# EAGLE design mcp2200 (EAGLE 9.0.0)
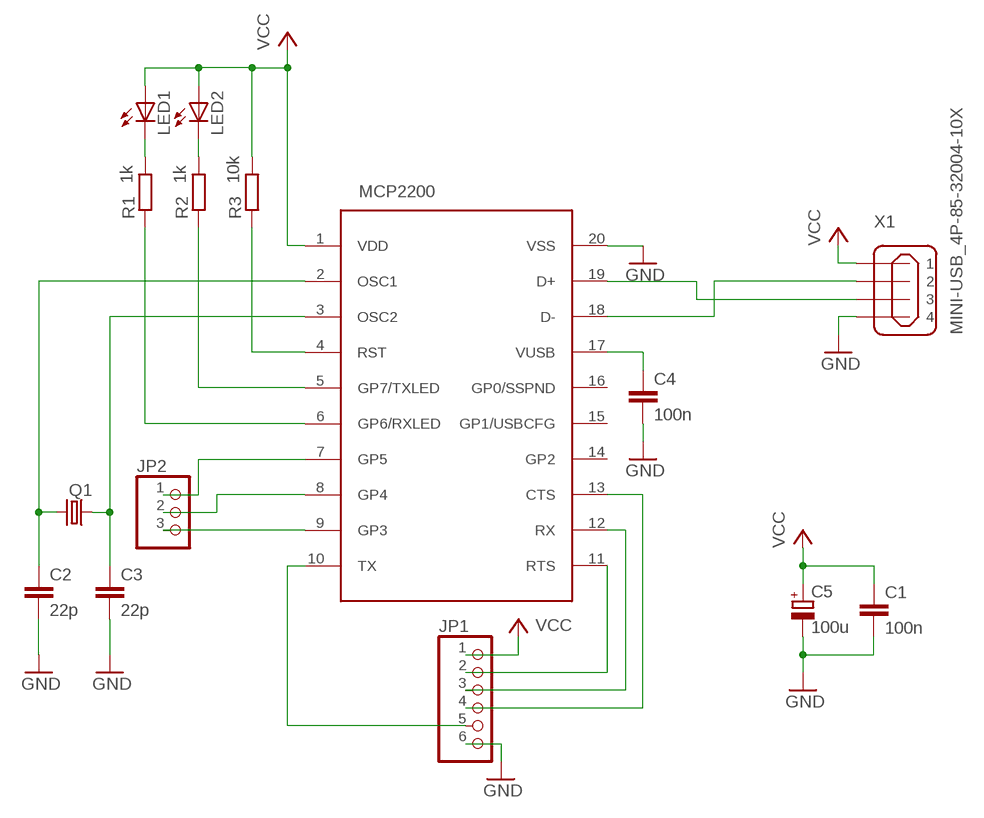
[diagram p0: schematic, sheet 1]

## Parts
C1  100n  C-EU025-025X050  [C025-025X050]
C2  22p  C-EU025-025X050  [C025-025X050]
C3  22p  C-EU025-025X050  [C025-025X050]
C4  100n  C-EU025-025X050  [C025-025X050]
C5  100u  CPOL-EUE3.5-8  [E3,5-8]
JP1  PINHD-1X6  [1X06]
JP2  PINHD-1X3  [1X03]
LED1  LED3MM  [LED3MM]
LED2  LED3MM  [LED3MM]
MCP2200  MCP2200  [SOIC127P1032X265-20]
Q1  CRYSTALHC49S  [HC49/S]
R1  1k  R-EU_R1206  [R1206]
R2  1k  R-EU_R1206  [R1206]
R3  10k  R-EU_R1206  [R1206]
X1  MINI-USB_4P-85-32004-10X  [85-32004-10X]

## Nets
GND: C1.2 C2.2 C3.2 C4.2 C5.- JP1.6 MCP2200.20(VSS) X1.4
N$1: LED2.K(C) R2.2
N$2: LED1.K(C) R1.2
N$3: MCP2200.5(GP7/TXLED) R2.1
N$4: MCP2200.6(GP6/RXLED) R1.1
N$5: C2.1 MCP2200.2(OSC1) Q1.2
N$6: C3.1 MCP2200.3(OSC2) Q1.1
N$7: MCP2200.4(RST) R3.1
N$8: MCP2200.18(D-) X1.2
N$9: MCP2200.19(D+) X1.3
N$10: C4.1 MCP2200.17(VUSB)
N$13: JP2.1 MCP2200.7(GP5)
N$14: JP2.2 MCP2200.8(GP4)
N$15: JP2.3 MCP2200.9(GP3)
N$18: JP1.5 MCP2200.10(TX)
N$19: JP1.4 MCP2200.13(CTS)
N$20: JP1.3 MCP2200.12(RX)
N$21: JP1.2 MCP2200.11(RTS)
VCC: C1.1 C5.+ JP1.1 LED1.A LED2.A MCP2200.1(VDD) R3.2 X1.1
Unconnected: MCP2200.14(GP2) MCP2200.15(GP1/USBCFG) MCP2200.16(GP0/SSPND)

## Notes on the sheet
- MCP2200

## Library data of the parts
C1-C4 = rcl:C-EU: CAPACITOR, European symbol; SPICEPREFIX: C
C5 = rcl:CPOL-EU: POLARIZED CAPACITOR, European symbol; SPICEPREFIX: C
JP1 = pinhead:PINHD-1X6: PIN HEADER
JP2 = pinhead:PINHD-1X3: PIN HEADER
LED1 LED2 = led:LED: LED OSRAM: - CHIPLED LG R971, LG N971, LY N971, LG Q971, LY Q971, LO R971, LY R971 LH N974, LH R974 LS Q976, LO Q976, LY Q976 LO Q996 - Hyper CHIPLED LW Q18S LB Q993, LB Q99A, LB R99A - SideLED LS A670, LO A670, LY A670, LG A670, LP A670 LB A673, LV A673, LT A673, LW A673 LH A674 LY A675 LS A676, LA A676, LO A676, LY A676, LW A676 LS A679, LY A679, LG A679 - Hyper Micro SIDELED® LS Y876, LA Y876, LO Y876, LY Y876 LT Y87S - SmartLED LW L88C, LW L88S LB L89C, LB L89S, LG L890 LS L89K, LO L89K, LY L89K LS L896, LA L896, LO L896, LY L896 - TOPLED LS T670, LO T670, LY T670, LG T670, LP T670 LSG T670, LSP T670, LSY T670, LOP T670, LYG T670 LG T671, LOG T671, LSG T671 LB T673, LV T673, LT T673, LW T673 LH T674 LS T676, LA T676, LO T676, LY T676, LB T676, LH T676, LSB T676, LW T676 LB T67C, LV T67C, LT T67C, LS T67K, LO T67K, LY T67K, LW E67C LS E67B, LA E67B, LO E67B, LY E67B, LB E67C, LV E67C, LT E67C LW T67C LS T679, LY T679, LG T679 LS T770, LO T770, LY T770, LG T770, LP T770 LB T773, LV T773, LT T773, LW T773 LH T774 LS E675, LA E675, LY E675, LS T675 LS T776, LA T776, LO T776, LY T776, LB T776 LHGB T686 LT T68C, LB T68C - Hyper Mini TOPLED® LB M676 - Mini TOPLED Santana® LG M470 LS M47K, LO M47K, LY M47K Source: http://www.osram.convergy.de LUXEON: - LUMILED® LXK2-PW12-R00, LXK2-PW12-S00, LXK2-PW14-U00, LXK2-PW14-V00 LXK2-PM12-R00, LXK2-PM12-S00, LXK2-PM14-U00 LXK2-PE12-Q00, LXK2-PE12-R00, LXK2-PE12-S00, LXK2-PE14-T00, LXK2-PE14-U00 LXK2-PB12-K00, LXK2-PB12-L00, LXK2-PB12-M00, LXK2-PB14-N00, LXK2-PB14-P00, LXK2-PB14-Q00 LXK2-PR12-L00, LXK2-PR12-M00, LXK2-PR14-Q00, LXK2-PR14-R00 LXK2-PD12-Q00, LXK2-PD12-R00, LXK2-PD12-S00 LXK2-PH12-R00, LXK2-PH12-S00 LXK2-PL12-P00, LXK2-PL12-Q00, LXK2-PL12-R00 Source: www.luxeon.com KINGBRIGHT: KA-3528ASYC Source: www.kingbright.com
MCP2200 = mcp2200:MCP2200
Q1 = crystal:CRYSTAL: CRYSTAL; OC_FARNELL: 1667008; OC_NEWARK: unknown
R1-R3 = rcl:R-EU_: RESISTOR, European symbol; SPICEPREFIX: R
X1 = con-cypressindustries:MINI-USB_4P-: MINI USB 4 Pol. Source: www.cypressindustries.com; OC_FARNELL: unknown; OC_NEWARK: unknown

## Board
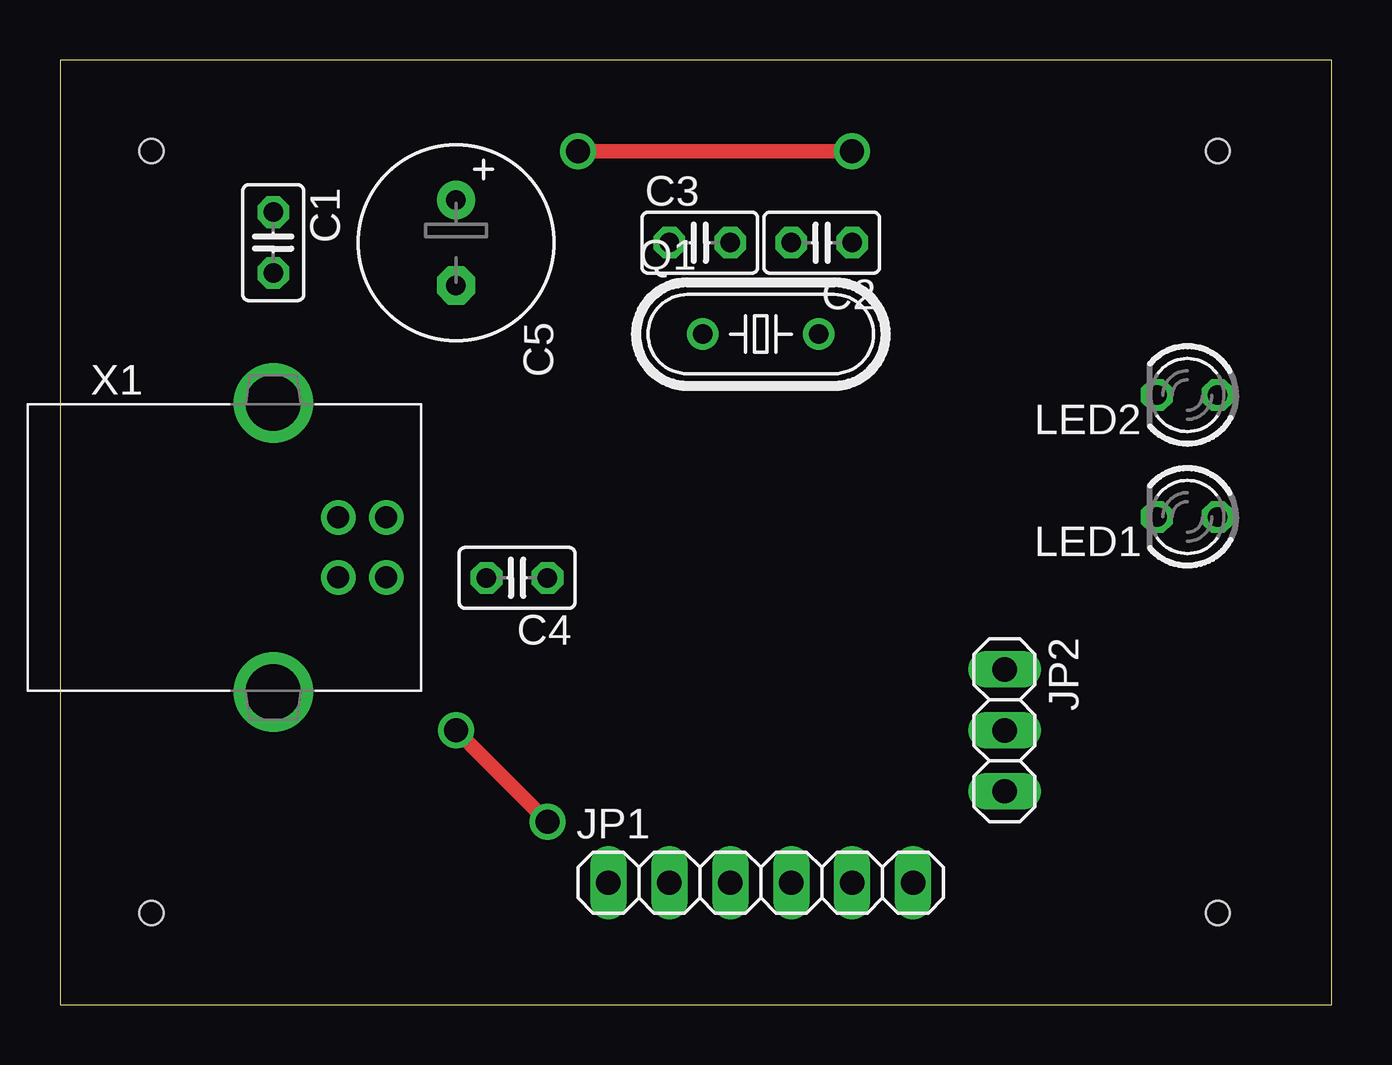
[diagram p1: board, top side]
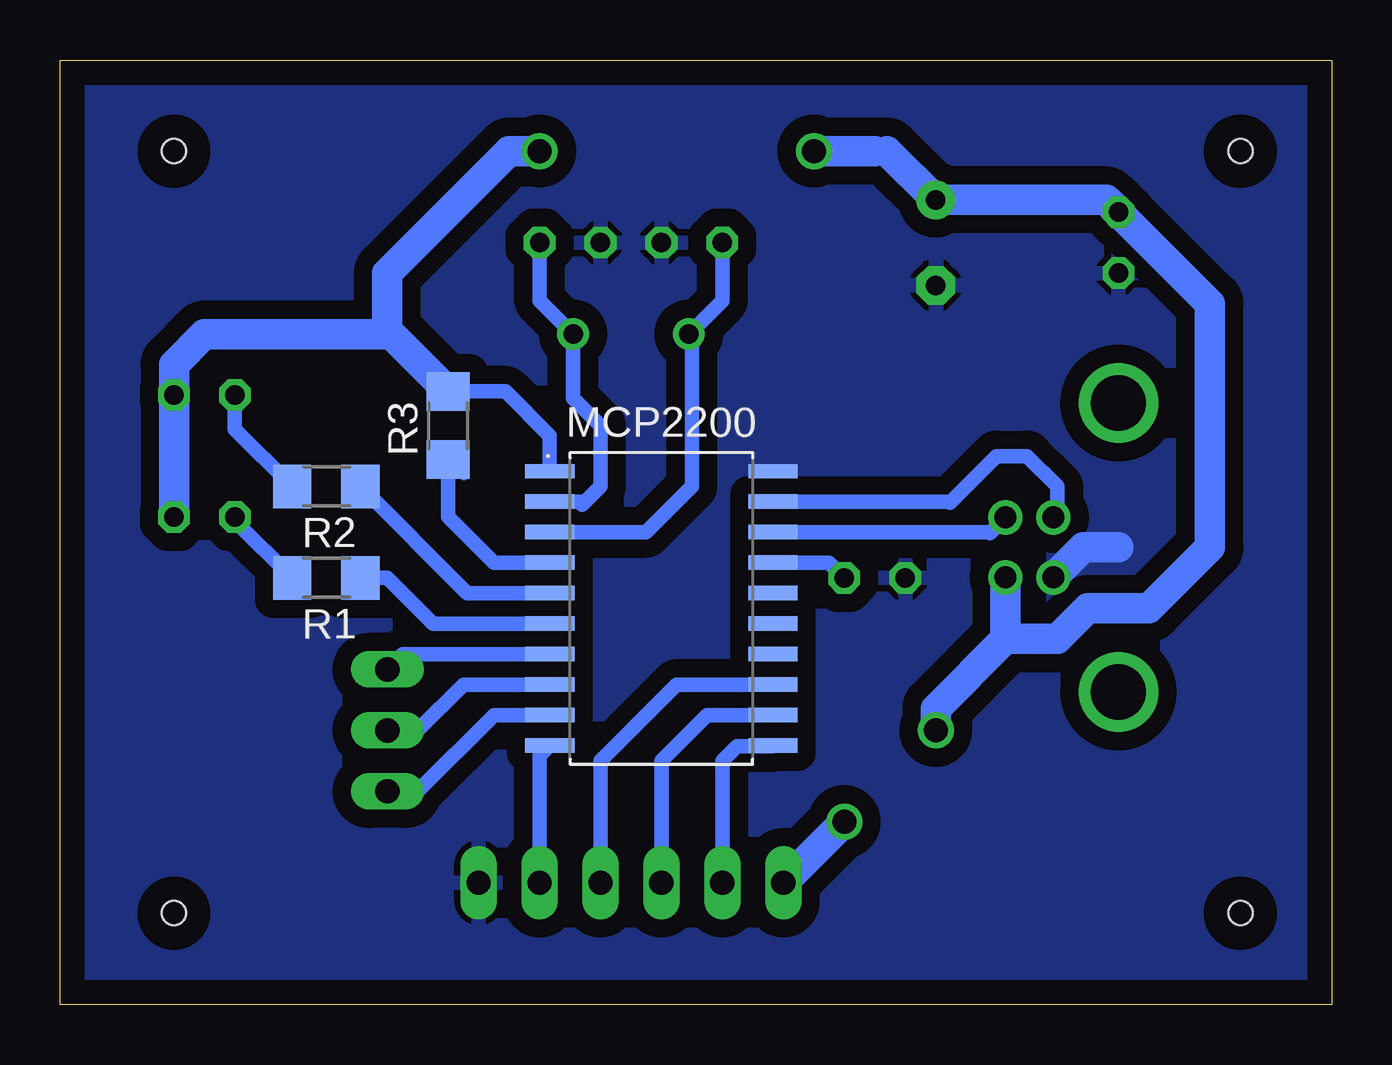
[diagram p2: board, bottom side, seen from below]

Size 53.01 x 39.36 mm. Coordinates in mm from the lower left corner, seen from the top.
Outline: 0,0 53.01,0 53.01,39.36 0,39.36 0,0
Copper layers (1*16): Top 0.035mm / dielectric 1.5mm / Bottom 0.035mm
Design rules "default *": minimum track width 6mil, minimum drill 0.35mm, track to track 30mil, track to pad 30mil, pad to pad 6mil, via to via 6mil, smd to smd 6mil, copper to edge 40mil, drill to drill 6mil, minimum pad ring 10mil, minimum via ring 8mil, stop-mask expansion 4mil, vias tented up to drill 0mil, thermal gap 10mil
Holes 1 mm at 3.81,35.56 3.81,3.81 48.26,3.81 48.26,35.56

### Footprints (pad centres in the part's own frame; a part is rotated, then mirrored left to right if it is on the bottom)
C025-025X050 = drill 0.813 octagon: 1 -1.27,0; 2 1.27,0
E3,5-8 = drill 0.813 pad 1.6: + -1.778,0 | drill 0.813 pad 1.6 octagon: - 1.778,0
1X06 = drill 1.016 long: 1 -6.35,0; 2 -3.81,0; 3 -1.27,0; 4 1.27,0; 5 3.81,0; 6 6.35,0
1X03 = drill 1.016 long: 1 -2.54,0; 2 0,0; 3 2.54,0
LED3MM = drill 0.813 octagon: A -1.27,0; K 1.27,0
SOIC127P1032X265-20 = smd 2.052 x 0.602: 1 -4.654,5.715; 2 -4.654,4.445; 3 -4.654,3.175; 4 -4.654,1.905; 5 -4.654,0.635; 6 -4.654,-0.635; 7 -4.654,-1.905; 8 -4.654,-3.175; 9 -4.654,-4.445; 10 -4.654,-5.715; 11 4.654,-5.715; 12 4.654,-4.445; 13 4.654,-3.175; 14 4.654,-1.905; 15 4.654,-0.635; 16 4.654,0.635; 17 4.654,1.905; 18 4.654,3.175; 19 4.654,4.445; 20 4.654,5.715
HC49/S = drill 0.813: 1 -2.413,0; 2 2.413,0
R1206 = smd 1.6 x 1.803: 1 -1.422,0; 2 1.422,0
85-32004-10X = drill 0.92 pad 1.27: 1 4.71,-1.25; 2 4.71,1.25; 3 2.71,1.25; 4 2.71,-1.25 | drill 2.3 pad 3: M1 0,6.02; M2 0,-6.02

### Placement (x,y rotation side)
C1  8.89,31.75 270 top
C2  31.75,31.75 180 top
C3  26.67,31.75 0 top
C4  19.05,17.78 180 top
C5  16.51,31.75 270 top
JP1  29.21,5.08 0 top
JP2  39.37,11.43 270 top
LED1  46.99,20.32 180 top
LED2  46.99,25.4 180 top
MCP2200  27.94,16.51 0 bottom
Q1  29.21,27.94 0 top
R1  41.91,17.78 180 bottom
R2  41.91,21.59 180 bottom
R3  36.83,24.13 90 bottom
X1  8.89,19.05 0 top

### Tracks (layer width: path | path; a pad name or v marks a point on that pad's centre or on a via)
GND
  Bottom 1.27: X1.4 10.35,19.05 8.89,19.05
  pour Bottom: 0,0 53.34,0 53.34,39.37 0,39.37
N$1
  Bottom 0.61: R2.2 45.72,23.98 LED2.K
N$2
  Bottom 0.61: R1.2 45.72,20.17 LED1.K
N$3
  Bottom 0.61: MCP2200.5 36.04,17.14 R2.1
N$4
  Bottom 0.61: R1.1 39.37,17.78 37.47,15.88 MCP2200.6
N$5
  Bottom 0.61: 31.11,20.95 31.25,20.82 | C2.1 33.02,29.34 Q1.2 31.62,25.27 30.48,24.13 30.48,21.59 31.11,20.95 | MCP2200.2 31.11,20.95
N$6
  Bottom 0.61: C3.1 25.4,29.34 Q1.1 26.67,27.81 26.67,21.59 28.57,19.68 MCP2200.3
N$7
  Bottom 0.406: 36.17,22.05 R3.1
  Bottom 0.61: R3.1 36.83,20.32 34.92,18.41 MCP2200.4
N$8
  Bottom 0.61: X1.2 14.25,19.65 14.29,19.68 MCP2200.18
N$9
  Bottom 0.61: X1.3 11.43,20.47 11.43,21.59 12.7,22.86 13.97,22.86 15.91,20.92 15.95,20.95 MCP2200.19
N$10
  Bottom 0.61: MCP2200.17 20.95,18.41 C4.1
N$13
  Bottom 0.61: MCP2200.7 38.73,14.61 JP2.1
N$14
  Bottom 0.61: JP2.2 38.1,11.43 36.2,13.34 MCP2200.8
N$15
  Bottom 0.61: JP2.3 38.1,8.89 34.92,12.06 MCP2200.9
N$18
  Bottom 0.61: JP1.5 33.02,10.37 MCP2200.10
N$19
  Bottom 0.61: JP1.4 30.48,10.16 27.3,13.34 MCP2200.13
N$20
  Bottom 0.61: JP1.3 27.94,10.16 26.04,12.06 MCP2200.12
N$21
  Bottom 0.61: JP1.2 25.4,10.16 24.8,10.76 23.32,10.76 MCP2200.11
VCC  (via drill 1)
  Top 0.61: v33.02,35.56 v21.59,35.56 | v20.32,7.62 v16.51,11.43
  Bottom 0.61: LED1.A LED2.A 48.26,26.67 | 18.54,35.56 19.05,35.56 | MCP2200.1 32.59,23.7 34.44,25.55 R3.2
  Bottom 1.27: 13.6,15.24 11.43,15.24 10.16,16.51 7.62,16.51 5.08,19.05 5.08,29.21 C1.1 9.4,33.53 C5.+ 18.54,35.56 | 19.05,35.56 v21.59,35.56 | v33.02,35.56 34.29,35.56 39.37,30.48 39.37,27.94 | 39.37,27.94 39.22,27.94 R3.2 | 39.37,27.94 46.99,27.94 48.26,26.67 LED1.A | X1.1 13.6,15.24 | 13.6,15.24 16.51,12.33 v16.51,11.43 | v20.32,7.62 JP1.1